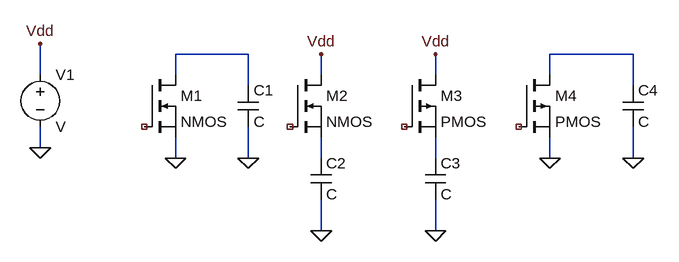
[diagram p0: schematic Draft1.asc]
Draft1.asc, the LTspice schematic file:
Version 4
SHEET 1 880 680
WIRE 192 32 80 32
WIRE 784 32 656 32
WIRE -128 64 -128 16
WIRE 80 64 80 32
WIRE 304 64 304 32
WIRE 480 64 480 32
WIRE 656 64 656 32
WIRE 192 80 192 32
WIRE 784 80 784 32
WIRE -128 176 -128 144
WIRE 80 192 80 160
WIRE 192 192 192 144
WIRE 304 192 304 160
WIRE 480 192 480 160
WIRE 656 192 656 160
WIRE 784 192 784 144
WIRE 304 304 304 256
WIRE 480 304 480 256
FLAG -128 176 0
FLAG -128 16 Vdd
FLAG 304 32 Vdd
FLAG 480 32 Vdd
FLAG 80 192 0
FLAG 192 192 0
FLAG 304 304 0
FLAG 480 304 0
FLAG 656 192 0
FLAG 784 192 0
SYMBOL nmos 32 64 R0
SYMATTR InstName M1
SYMBOL nmos 256 64 R0
SYMATTR InstName M2
SYMBOL pmos 432 64 R0
SYMATTR InstName M3
SYMBOL pmos 608 64 R0
SYMATTR InstName M4
SYMBOL voltage -128 48 R0
SYMATTR InstName V1
SYMBOL cap 176 80 R0
SYMATTR InstName C1
SYMBOL cap 288 192 R0
SYMATTR InstName C2
SYMBOL cap 464 192 R0
SYMATTR InstName C3
SYMBOL cap 768 80 R0
SYMATTR InstName C4

The netlist it stands for:
* Draft1.asc
M1 N001 NC_01 0 0 NMOS
M2 Vdd NC_02 N003 N003 NMOS
M3 Vdd NC_03 N004 N004 PMOS
M4 N002 NC_04 0 0 PMOS
V1 Vdd 0 V
C1 N001 0 C
C2 N003 0 C
C3 N004 0 C
C4 N002 0 C
.model NMOS NMOS
.model PMOS PMOS
.lib standard.mos
.backanno
.end